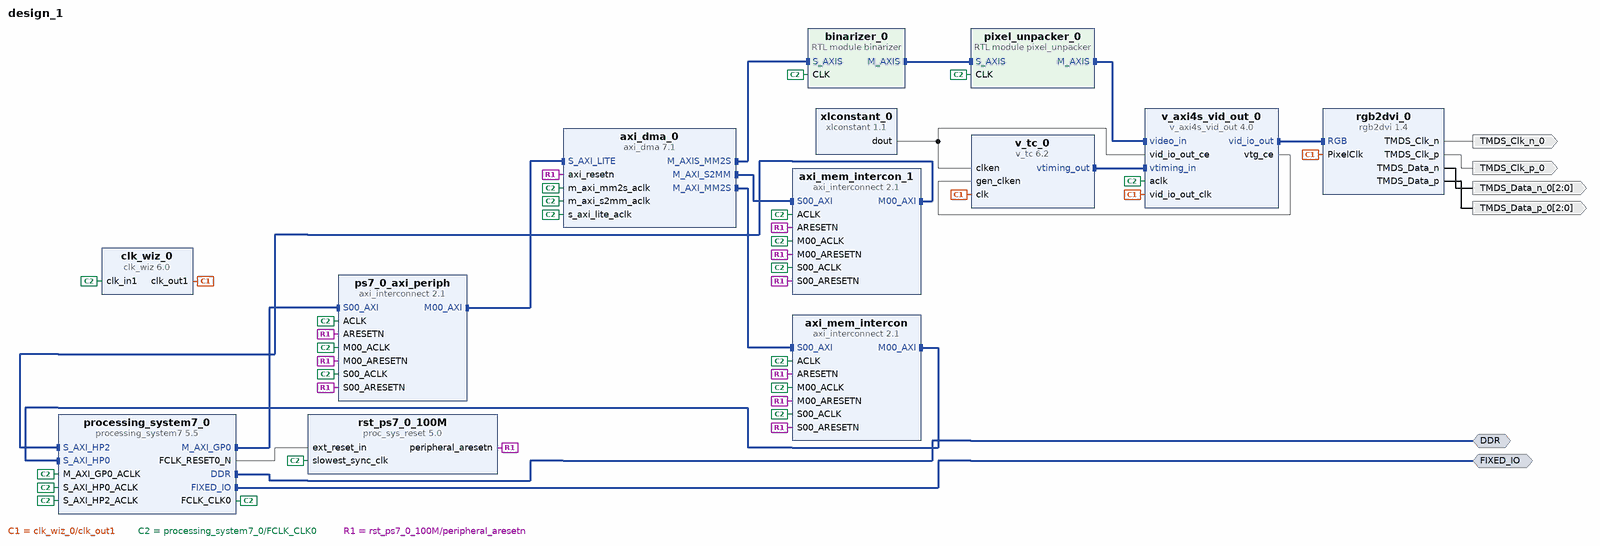
[diagram p0: block diagram of the top level]
# Vivado block design design_1, xc7z020clg400-1, Vivado 2024.1
create_bd_design design_1

create_bd_intf_port -mode Master -vlnv xilinx.com:interface:ddrx_rtl:1.0 DDR
create_bd_intf_port -mode Master -vlnv xilinx.com:display_processing_system7:fixedio_rtl:1.0 FIXED_IO
create_bd_port -dir O -type clk TMDS_Clk_n_0
create_bd_port -dir O -from 2 -to 0 TMDS_Data_p_0
create_bd_port -dir O -from 2 -to 0 TMDS_Data_n_0
create_bd_port -dir O -type clk TMDS_Clk_p_0

create_bd_cell -type ip -vlnv xilinx.com:ip:processing_system7:5.5 processing_system7_0
set_property -dict [list \
  CONFIG.PCW_APU_PERIPHERAL_FREQMHZ 650 \
  CONFIG.PCW_CRYSTAL_PERIPHERAL_FREQMHZ 50 \
  CONFIG.PCW_ENET0_ENET0_IO {MIO 16 .. 27} \
  CONFIG.PCW_ENET0_GRP_MDIO_ENABLE 1 \
  CONFIG.PCW_ENET0_GRP_MDIO_IO {MIO 52 .. 53} \
  CONFIG.PCW_ENET0_PERIPHERAL_ENABLE 1 \
  CONFIG.PCW_ENET0_RESET_ENABLE 1 \
  CONFIG.PCW_ENET0_RESET_IO {MIO 9} \
  CONFIG.PCW_ENET_RESET_ENABLE 1 \
  CONFIG.PCW_ENET_RESET_SELECT {Share reset pin} \
  CONFIG.PCW_EN_CLK1_PORT 1 \
  CONFIG.PCW_FPGA0_PERIPHERAL_FREQMHZ 100 \
  CONFIG.PCW_FPGA1_PERIPHERAL_FREQMHZ 45 \
  CONFIG.PCW_FPGA_FCLK1_ENABLE 1 \
  CONFIG.PCW_GPIO_MIO_GPIO_ENABLE 1 \
  CONFIG.PCW_GPIO_MIO_GPIO_IO MIO \
  CONFIG.PCW_I2C_RESET_ENABLE 0 \
  CONFIG.PCW_M_AXI_GP0_FREQMHZ 10 \
  CONFIG.PCW_PERIPHERAL_BOARD_PRESET part0 \
  CONFIG.PCW_PRESET_BANK1_VOLTAGE {LVCMOS 1.8V} \
  CONFIG.PCW_QSPI_GRP_FBCLK_ENABLE 1 \
  CONFIG.PCW_QSPI_GRP_FBCLK_IO {MIO 8} \
  CONFIG.PCW_QSPI_GRP_SINGLE_SS_ENABLE 1 \
  CONFIG.PCW_QSPI_GRP_SINGLE_SS_IO {MIO 1 .. 6} \
  CONFIG.PCW_QSPI_PERIPHERAL_ENABLE 1 \
  CONFIG.PCW_QSPI_QSPI_IO {MIO 1 .. 6} \
  CONFIG.PCW_SD0_GRP_CD_ENABLE 1 \
  CONFIG.PCW_SD0_GRP_CD_IO {MIO 47} \
  CONFIG.PCW_SD0_GRP_WP_ENABLE 0 \
  CONFIG.PCW_SD0_PERIPHERAL_ENABLE 1 \
  CONFIG.PCW_SD0_SD0_IO {MIO 40 .. 45} \
  CONFIG.PCW_SDIO_PERIPHERAL_FREQMHZ 50 \
  CONFIG.PCW_SINGLE_QSPI_DATA_MODE x4 \
  CONFIG.PCW_S_AXI_HP0_FREQMHZ 10 \
  CONFIG.PCW_UART0_PERIPHERAL_ENABLE 1 \
  CONFIG.PCW_UART0_UART0_IO {MIO 14 .. 15} \
  CONFIG.PCW_UART1_PERIPHERAL_ENABLE 0 \
  CONFIG.PCW_UART_PERIPHERAL_FREQMHZ 100 \
  CONFIG.PCW_UIPARAM_DDR_BUS_WIDTH {16 Bit} \
  CONFIG.PCW_UIPARAM_DDR_FREQ_MHZ 525 \
  CONFIG.PCW_UIPARAM_DDR_PARTNO {MT41J256M16 RE-125} \
  CONFIG.PCW_USB0_PERIPHERAL_ENABLE 1 \
  CONFIG.PCW_USB0_RESET_ENABLE 1 \
  CONFIG.PCW_USB0_RESET_IO {MIO 46} \
  CONFIG.PCW_USB0_USB0_IO {MIO 28 .. 39} \
  CONFIG.PCW_USB_RESET_ENABLE 1 \
  CONFIG.PCW_USB_RESET_SELECT {Share reset pin} \
  CONFIG.PCW_USE_S_AXI_HP0 1 \
  CONFIG.PCW_USE_S_AXI_HP2 1 \
  CONFIG.preset None \
] [get_bd_cells processing_system7_0]
# 500 more settings of processing_system7_0 are not shown: defaults, MIO pin electricals, DDR timing, and values the tool derives
create_bd_cell -type ip -vlnv xilinx.com:ip:axi_dma:7.1 axi_dma_0
set_property -dict [list \
  CONFIG.c_include_sg 0 \
  CONFIG.c_m_axi_mm2s_data_width 32 \
  CONFIG.c_m_axis_mm2s_tdata_width 32 \
  CONFIG.c_sg_length_width 26 \
] [get_bd_cells axi_dma_0]
create_bd_cell -type ip -vlnv xilinx.com:ip:axi_interconnect:2.1 ps7_0_axi_periph
set_property -dict {CONFIG.NUM_MI 1} [get_bd_cells ps7_0_axi_periph]
create_bd_cell -type ip -vlnv xilinx.com:ip:proc_sys_reset:5.0 rst_ps7_0_100M
create_bd_cell -type ip -vlnv xilinx.com:ip:axi_interconnect:2.1 axi_mem_intercon
set_property -dict {CONFIG.NUM_MI 1} [get_bd_cells axi_mem_intercon]
create_bd_cell -type ip -vlnv xilinx.com:ip:axi_interconnect:2.1 axi_mem_intercon_1
set_property -dict {CONFIG.NUM_MI 1} [get_bd_cells axi_mem_intercon_1]
create_bd_cell -type module -reference binarizer binarizer_0
create_bd_cell -type ip -vlnv xilinx.com:ip:v_tc:6.2 v_tc_0
set_property -dict {CONFIG.HAS_AXI4_LITE false CONFIG.enable_detection false} [get_bd_cells v_tc_0]
create_bd_cell -type module -reference pixel_unpacker pixel_unpacker_0
create_bd_cell -type ip -vlnv xilinx.com:ip:v_axi4s_vid_out:4.0 v_axi4s_vid_out_0
set_property -dict {CONFIG.C_HAS_ASYNC_CLK 1} [get_bd_cells v_axi4s_vid_out_0]
create_bd_cell -type ip -vlnv digilentinc.com:ip:rgb2dvi:1.4 rgb2dvi_0
set_property -dict {CONFIG.kClkRange 3} [get_bd_cells rgb2dvi_0]
create_bd_cell -type ip -vlnv xilinx.com:ip:clk_wiz:6.0 clk_wiz_0
set_property -dict [list \
  CONFIG.CLKOUT1_JITTER 245.495 \
  CONFIG.CLKOUT1_PHASE_ERROR 245.344 \
  CONFIG.CLKOUT1_REQUESTED_OUT_FREQ 74.25 \
  CONFIG.MMCM_CLKFBOUT_MULT_F 37.125 \
  CONFIG.MMCM_CLKOUT0_DIVIDE_F 12.500 \
  CONFIG.MMCM_DIVCLK_DIVIDE 4 \
  CONFIG.USE_LOCKED false \
  CONFIG.USE_RESET false \
] [get_bd_cells clk_wiz_0]
create_bd_cell -type ip -vlnv xilinx.com:ip:xlconstant:1.1 xlconstant_0

# ---- connections ----

connect_bd_intf_net [get_bd_intf_pins axi_dma_0/M_AXIS_MM2S] [get_bd_intf_pins binarizer_0/S_AXIS]
connect_bd_intf_net [get_bd_intf_pins axi_dma_0/M_AXI_MM2S] [get_bd_intf_pins axi_mem_intercon/S00_AXI]
connect_bd_intf_net [get_bd_intf_pins axi_dma_0/M_AXI_S2MM] [get_bd_intf_pins axi_mem_intercon_1/S00_AXI]
connect_bd_intf_net [get_bd_intf_pins axi_mem_intercon_1/M00_AXI] [get_bd_intf_pins processing_system7_0/S_AXI_HP2]
connect_bd_intf_net [get_bd_intf_pins axi_mem_intercon/M00_AXI] [get_bd_intf_pins processing_system7_0/S_AXI_HP0]
connect_bd_intf_net [get_bd_intf_pins binarizer_0/M_AXIS] [get_bd_intf_pins pixel_unpacker_0/S_AXIS]
connect_bd_intf_net [get_bd_intf_pins pixel_unpacker_0/M_AXIS] [get_bd_intf_pins v_axi4s_vid_out_0/video_in]
connect_bd_intf_net [get_bd_intf_ports DDR] [get_bd_intf_pins processing_system7_0/DDR]
connect_bd_intf_net [get_bd_intf_ports FIXED_IO] [get_bd_intf_pins processing_system7_0/FIXED_IO]
connect_bd_intf_net [get_bd_intf_pins processing_system7_0/M_AXI_GP0] [get_bd_intf_pins ps7_0_axi_periph/S00_AXI]
connect_bd_intf_net [get_bd_intf_pins ps7_0_axi_periph/M00_AXI] [get_bd_intf_pins axi_dma_0/S_AXI_LITE]
connect_bd_intf_net [get_bd_intf_pins v_axi4s_vid_out_0/vid_io_out] [get_bd_intf_pins rgb2dvi_0/RGB]
connect_bd_intf_net [get_bd_intf_pins v_tc_0/vtiming_out] [get_bd_intf_pins v_axi4s_vid_out_0/vtiming_in]
connect_bd_net [get_bd_pins clk_wiz_0/clk_out1] \
  [get_bd_pins rgb2dvi_0/PixelClk] [get_bd_pins v_axi4s_vid_out_0/vid_io_out_clk] [get_bd_pins v_tc_0/clk]
connect_bd_net [get_bd_pins processing_system7_0/FCLK_CLK0] \
  [get_bd_pins processing_system7_0/M_AXI_GP0_ACLK] [get_bd_pins ps7_0_axi_periph/S00_ACLK] \
  [get_bd_pins rst_ps7_0_100M/slowest_sync_clk] [get_bd_pins axi_dma_0/s_axi_lite_aclk] \
  [get_bd_pins ps7_0_axi_periph/M00_ACLK] [get_bd_pins ps7_0_axi_periph/ACLK] [get_bd_pins axi_dma_0/m_axi_mm2s_aclk] \
  [get_bd_pins axi_mem_intercon/S00_ACLK] [get_bd_pins processing_system7_0/S_AXI_HP0_ACLK] \
  [get_bd_pins axi_mem_intercon/M00_ACLK] [get_bd_pins axi_mem_intercon/ACLK] [get_bd_pins axi_dma_0/m_axi_s2mm_aclk] \
  [get_bd_pins axi_mem_intercon_1/S00_ACLK] [get_bd_pins processing_system7_0/S_AXI_HP2_ACLK] \
  [get_bd_pins axi_mem_intercon_1/M00_ACLK] [get_bd_pins axi_mem_intercon_1/ACLK] [get_bd_pins binarizer_0/CLK] \
  [get_bd_pins pixel_unpacker_0/CLK] [get_bd_pins v_axi4s_vid_out_0/aclk] [get_bd_pins clk_wiz_0/clk_in1]
connect_bd_net [get_bd_pins processing_system7_0/FCLK_RESET0_N] [get_bd_pins rst_ps7_0_100M/ext_reset_in]
connect_bd_net [get_bd_pins rgb2dvi_0/TMDS_Clk_n] [get_bd_ports TMDS_Clk_n_0]
connect_bd_net [get_bd_pins rgb2dvi_0/TMDS_Clk_p] [get_bd_ports TMDS_Clk_p_0]
connect_bd_net [get_bd_pins rgb2dvi_0/TMDS_Data_n] [get_bd_ports TMDS_Data_n_0]
connect_bd_net [get_bd_pins rgb2dvi_0/TMDS_Data_p] [get_bd_ports TMDS_Data_p_0]
connect_bd_net [get_bd_pins rst_ps7_0_100M/peripheral_aresetn] \
  [get_bd_pins ps7_0_axi_periph/S00_ARESETN] [get_bd_pins axi_dma_0/axi_resetn] [get_bd_pins ps7_0_axi_periph/M00_ARESETN] \
  [get_bd_pins ps7_0_axi_periph/ARESETN] [get_bd_pins axi_mem_intercon/S00_ARESETN] \
  [get_bd_pins axi_mem_intercon/M00_ARESETN] [get_bd_pins axi_mem_intercon/ARESETN] \
  [get_bd_pins axi_mem_intercon_1/S00_ARESETN] [get_bd_pins axi_mem_intercon_1/M00_ARESETN] \
  [get_bd_pins axi_mem_intercon_1/ARESETN]
connect_bd_net [get_bd_pins v_axi4s_vid_out_0/vtg_ce] [get_bd_pins v_tc_0/gen_clken]
connect_bd_net [get_bd_pins xlconstant_0/dout] [get_bd_pins v_tc_0/clken] [get_bd_pins v_axi4s_vid_out_0/vid_io_out_ce]

# ---- address map ----
assign_bd_address -offset 0x00000000 -range 512M -target_address_space [get_bd_addr_spaces axi_dma_0/Data_MM2S] [get_bd_addr_segs processing_system7_0/S_AXI_HP0/HP0_DDR_LOWOCM]
assign_bd_address -offset 0x00000000 -range 512M -target_address_space [get_bd_addr_spaces axi_dma_0/Data_S2MM] [get_bd_addr_segs processing_system7_0/S_AXI_HP2/HP2_DDR_LOWOCM]
assign_bd_address -offset 0x40400000 -range 64K -target_address_space [get_bd_addr_spaces processing_system7_0/Data] [get_bd_addr_segs axi_dma_0/S_AXI_LITE/Reg]

validate_bd_design
save_bd_design
